# Altium schematic sheet daughterboard.SchDoc
size A4; SheetNumber: 1; SheetTotal: 2
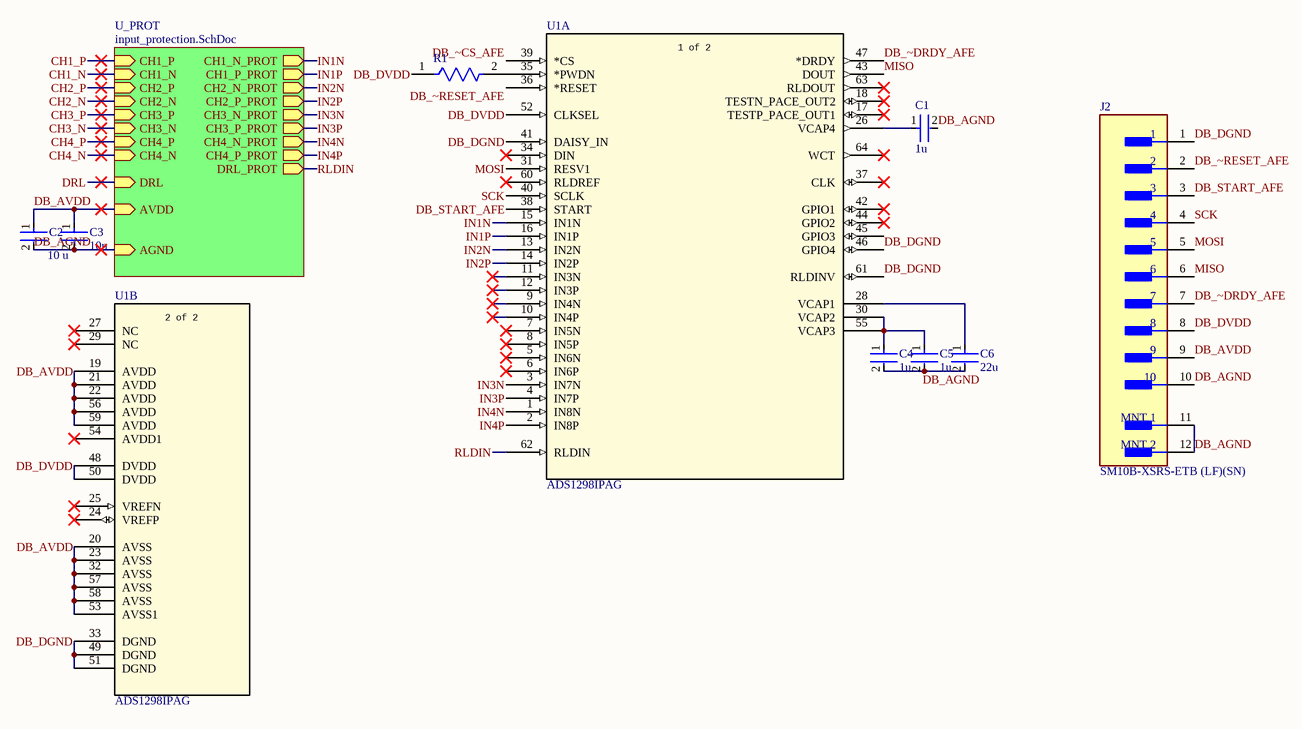
[diagram p0: daughterboard.SchDoc]

## Parts
C1  1u  [FP-CC1206-1_25-MFG]
C2  10 u  [FP-ZRB15X-0_22-MFG]
C3  10n  [FP-C0805C103K8RACAUTO-MFG]
C4  1u  [FP-CC1206-1_25-MFG]
C5  1u  [FP-CC1206-1_25-MFG]
C6  22u  [FP-GCJ31C-0_3-MFG]
J2  SM10B-XSRS-ETB (LF)(SN)  [FP-SM10B-XSRS-ETB_LF_SN-MFG]
R1  10k - RN73R2BTTD1001F25  [FP-RN73R2B-MFG]  (value not drawn)
U1  ADS1298IPAG  [PAG64]  (parts A,B of 2)

## Sub-sheets
U_PROT = input_protection.SchDoc: CH1_P (in), CH1_N_PROT (out), CH1_P_PROT (out), CH1_N (in), CH2_P (in), CH2_N (in), CH3_P (in), CH3_N (in), CH4_P (in), CH4_N (in), DRL (in), AVDD (in), AGND (in), CH2_N_PROT (out), CH2_P_PROT (out), CH3_N_PROT (out), CH3_P_PROT (out), CH4_N_PROT (out), CH4_P_PROT (out), DRL_PROT (out)

## Nets
CH1_N: sheet U_PROT/CH1_N
CH1_P: sheet U_PROT/CH1_P
CH2_N: sheet U_PROT/CH2_N
CH2_P: sheet U_PROT/CH2_P
CH3_N: sheet U_PROT/CH3_N
CH3_P: sheet U_PROT/CH3_P
CH4_N: sheet U_PROT/CH4_N
CH4_P: sheet U_PROT/CH4_P
DB_AGND: C1.2 C2.2 C3.2 C4.2 C5.2 C6.2 J2.10 J2.11(MNT_1) J2.12(MNT_2) ; sheet U_PROT/AGND
DB_AVDD: C2.1 C3.1 J2.9 U1.19(AVDD) U1.20(AVSS) U1.21(AVDD) U1.22(AVDD) U1.23(AVSS) U1.32(AVSS) U1.53(AVSS1) U1.56(AVDD) U1.57(AVSS) U1.58(AVSS) U1.59(AVDD) ; sheet U_PROT/AVDD
DB_DGND: J2.1 U1.33(DGND) U1.41(DAISY_IN) U1.46(GPIO4) U1.49(DGND) U1.51(DGND) U1.61(RLDINV)
DB_DVDD: J2.8 R1.1 U1.48(DVDD) U1.50(DVDD) U1.52(CLKSEL)
DB_START_AFE: J2.3 U1.38(START)
DB_~CS_AFE: U1.39(*CS)
DB_~DRDY_AFE: J2.7 U1.47(*DRDY)
DB_~RESET_AFE: J2.2 U1.36(*RESET)
DRL: sheet U_PROT/DRL
IN1N: U1.15(IN1N) ; sheet U_PROT/CH1_N_PROT
IN1P: U1.16(IN1P) ; sheet U_PROT/CH1_P_PROT
IN2N: U1.13(IN2N) ; sheet U_PROT/CH2_N_PROT
IN2P: U1.14(IN2P) ; sheet U_PROT/CH2_P_PROT
IN3N: U1.3(IN7N) ; sheet U_PROT/CH3_N_PROT
IN3P: U1.4(IN7P) ; sheet U_PROT/CH3_P_PROT
IN4N: U1.1(IN8N) ; sheet U_PROT/CH4_N_PROT
IN4P: U1.2(IN8P) ; sheet U_PROT/CH4_P_PROT
MISO: J2.6 U1.43(DOUT)
MOSI: J2.5 U1.31(RESV1)
RLDIN: U1.62(RLDIN) ; sheet U_PROT/DRL_PROT
SCK: J2.4 U1.40(SCLK)
NetC1_1: C1.1 U1.26(VCAP4)
NetC4_1: C4.1 C5.1 U1.30(VCAP2) U1.55(VCAP3)
NetC6_1: C6.1 U1.28(VCAP1)
NetR1_2: R1.2 U1.35(*PWDN)

Not connected (* = marked no-connect by the designer): U1 5(IN6N)* 6(IN6P)* 7(IN5N)* 8(IN5P)* 9(IN4N)* 10(IN4P)* 11(IN3N)* 12(IN3P)* 17(TESTP_PACE_OUT1)* 18(TESTN_PACE_OUT2)* 24(VREFP)* 25(VREFN)* 27(NC)* 29(NC)* 34(DIN)* 37(CLK)* 42(GPIO1)* 44(GPIO2)* 45(GPIO3) 54(AVDD1)* 60(RLDREF)* 63(RLDOUT)* 64(WCT)*

## Notes on the sheet
- (in symbol ADS1298IPAG, part A) 1 of 2
- (in symbol ADS1298IPAG, part B) 2 of 2

## Library data of the parts
C1 C4 C5 = CMP-03422-001151-1: CC1206 1 uF X7R 10.00%16 V; Manufacturer: Yageo; Manufacturer Part Number: CC1206KFX7R7BB105; Voltage Rating: 16 V; Automotive Grade: NA; Capacitance: 1 uF; Temperature Coefficient: 15%; Material: Ceramic; Tolerance: 0.1; Value: 1 uF; Category: Cap; Temperature: -55°C to +125°C; Temperature Range Low: -55°C; Package: CC1206-1.25; ComponentLink2Description: Datasheet; RoHS: TRUE; Footprint Url: http://www.yageo.com/exep/pages/download/literatures/UPY-C_GEN_24.pdf; Temperature Characteristic: X7R; ComponentLink2URL: http://www.yageo.com/documents/recent/UPY-NP0X7R_HV_1KV-to-3KV_11.pdf; Height: 1.45mm; Mouser Description: Multilayer Ceramic Capacitors MLCC - SMD/SMT 1.0uF 16V X7R 10%; Lead Free: Yes; Temperature Range High: +125°C; Device Class L1: Passive Components; Octopart: https://octopart.com/cc1206kfx7r7bb105-yageo-22250947; Automotive: No; Device Class L3: Ceramic Capacitors; Device Class L2: Capacitors
C2 = CMP-06035-063245-1: Multilayer Ceramic Capacitors on Interposer Board for General Purpose 10μF ±20% 4VDC X6S  SMD  0402
C3 = CMP-00212-126448506-1: C0805C103K8RACAUTO Cap, 0.01UF, 10V, Mlcc, 0805 Rohs Compliant: Yes; Material: Ceramic; Capacitance: 10nF; Dielectric: X7R; Tolerance: 10%; Height: 880µm; NexarPartId: 126448506; Voltage Rating: 10V; Voltage Rating (DC): 10V; Min Operating Temperature: -55°C; Max Operating Temperature: 125°C; Case/Package: 0805; RoHS: Compliant
C6 = CMP-06035-003359-1: Cap Ceramic 22uF 10V X7R 20% Pad SMD 1206 Soft Termination  +125°C Automotive T/R
J2 = CMP-17439-000651-1: CONN HEADER SMD R/A 10POS 0.6MM; Voltage Rating: 30V; Current Rating: 200mA; Number of Contacts: 10; Fastening Type: Friction; Packaging: Cut Tape; Insulation Material: Nylon; Contact Shape: Rectangular; Insulation Color: Natural; Max Operating Temperature: 85°C; Min Operating Temperature: -25°C; Orientation: Straight; Contact Type: Outer Shroud Contact; Number of Rows: 1; Pitch: 0.6mm; Series: XSR; Connector Type: Header; Flammability Rating: UL94 V-0; Contact Material: Copper Alloy; Mount: Surface Mount; Termination: Solder; Contact Finish - Mating: TIN
R1 = CMP-04015-029161-1: 1kΩ ±1% 0.25W, 1/4W Chip Resistor 1206 (3216 Metric) Moisture Resistant Thin Film
U1 = ADS1298IPAG: 8-Channel 24-bit ADC With Integrated ECG Front End 64-TQFP -40 to 85; Manufacturer_Name: Texas Instruments; Copyright: Copyright (C) 2026 Ultra Librarian. All rights reserved.; Manufacturer_Part_Number: ADS1298IPAG; RefDes: RefDes; Type: Type